# Altium project Jellyfish.PrjPCB
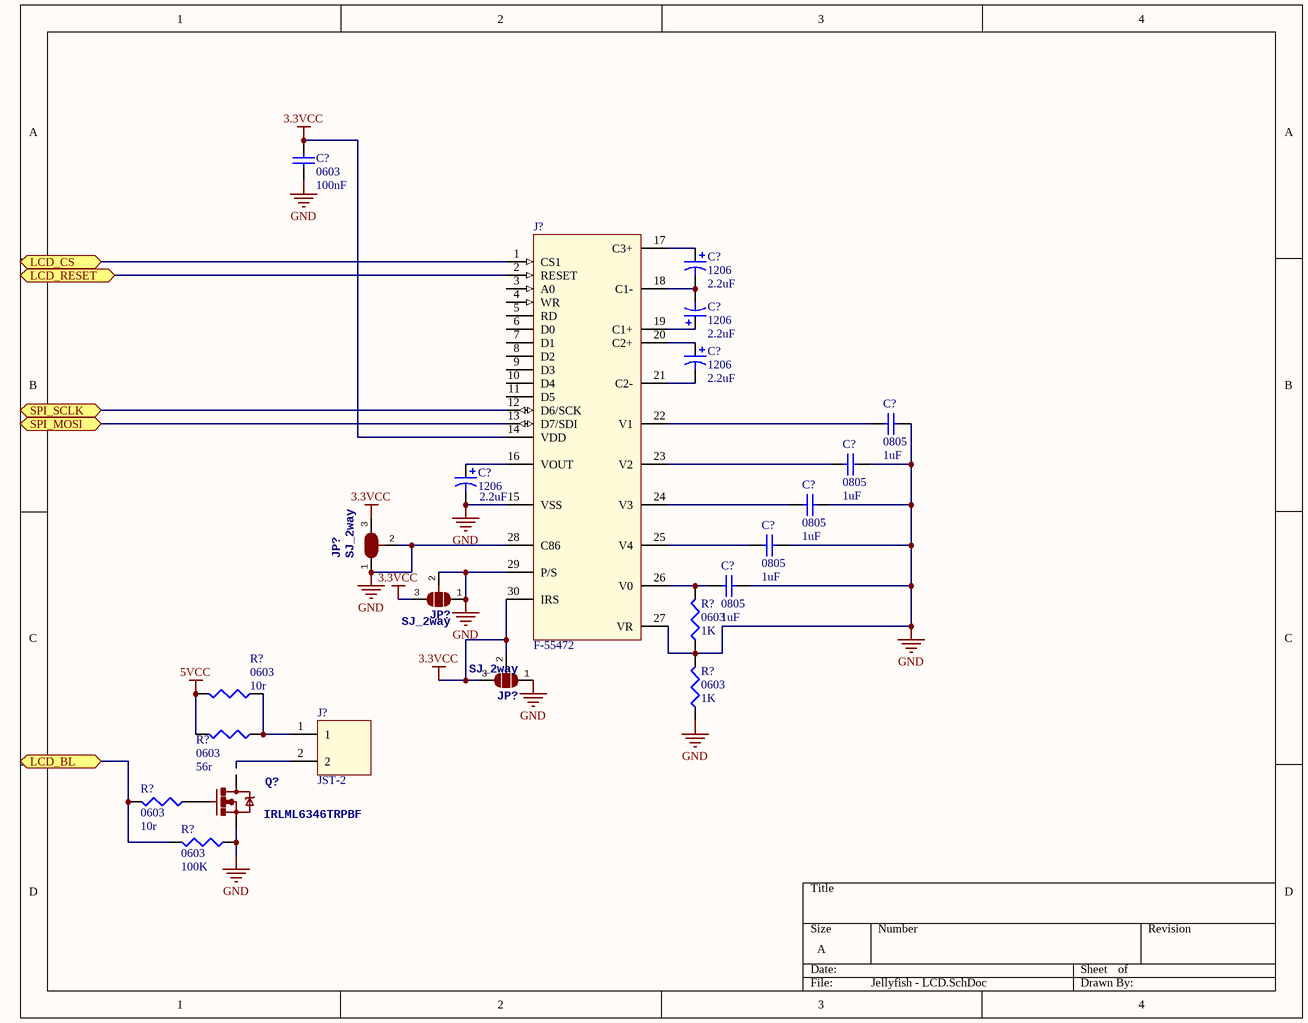
[diagram p0: Jellyfish - LCD.SchDoc]
4 sheets, 69 parts. Net scope: flat (ports and power ports of the same name join across sheets).
Sheets:
  Jellyfish - LCD.SchDoc
  Jellyfish - MCU KL05.SchDoc
  Jellyfish - Connector and SD Slot.SchDoc
  Jellyfish - LEDs & Buzzer.SchDoc

## Sheet Jellyfish - LCD.SchDoc
size A

### Parts
(Parts that share a designator on the sheet are numbered #1, #2 ... from top to bottom, then left to right.)
C?#1  0603  value 100nF  [1608[0603]]
C?#2  1206  value 2.2uF  [C1206Tantalum]
C?#3  1206  value 2.2uF  [C1206Tantalum]
C?#4  1206  value 2.2uF  [C1206Tantalum]
C?#5  0805  value 1uF  [SM 0805 - gap trimmed]
C?#6  0805  value 1uF  [SM 0805 - gap trimmed]
C?#7  1206  value 2.2uF  [C1206Tantalum]
C?#8  0805  value 1uF  [SM 0805 - gap trimmed]
C?#9  0805  value 1uF  [SM 0805 - gap trimmed]
C?#10  0805  value 1uF  [SM 0805 - gap trimmed]
J?#1  F-55472  [10051922-3010ELF]
J?#2  JST-2  [JST-2]
JP?#1  SJ_2way  [SJ-2way]
JP?#2  SJ_2way  [SJ-2way]
JP?#3  SJ_2way  [SJ-2way]
Q?  IRLML6346TRPBF  [SOT23-3]
R?#1  0603  value 1K  [J1-0603]
R?#2  0603  value 10r  [J1-0603]
R?#3  0603  value 1K  [J1-0603]
R?#4  0603  value 56r  [J1-0603]
R?#5  0603  value 10r  [J1-0603]
R?#6  0603  value 100K  [J1-0603]

### Ports
LCD_BL, LCD_CS, LCD_RESET, SPI_MOSI, SPI_SCLK

### Nets
3.3VCC: C?#1.2 J?#1.14(VDD) J?#1.30(IRS) JP?#1.3 JP?#2.3 JP?#3.2 JP?#3.3
5VCC: R?#2.2 R?#4.2
GND: C?#1.1 C?#5.2 C?#6.2 C?#7.2 C?#8.2 C?#9.2 C?#10.2 J?#1.15(VSS) J?#1.27(VR) J?#1.28(C86) J?#1.29(P/S) JP?#1.1 JP?#1.2 JP?#2.1 JP?#2.2 JP?#3.1 Q?.2(S) R?#1.1 R?#3.1 R?#3.2 R?#6.1
LCD_CS: J?#1.1(CS1) ; port LCD_CS
LCD_RESET: J?#1.2(RESET) ; port LCD_RESET
SPI_MOSI: J?#1.13(D7/SDI) ; port SPI_MOSI
SPI_SCLK: J?#1.12(D6/SCK) ; port SPI_SCLK
NetC?#2_1: C?#2.1 J?#1.17(C3+)
NetC?#2_2: C?#2.2 C?#3.2 J?#1.18(C1-)
NetC?#3_1: C?#3.1 J?#1.19(C1+)
NetC?#4_1: C?#4.1 J?#1.20(C2+)
NetC?#4_2: C?#4.2 J?#1.21(C2-)
NetC?#5_1: C?#5.1 J?#1.22(V1)
NetC?#6_1: C?#6.1 J?#1.23(V2)
NetC?#7_1: C?#7.1 J?#1.16(VOUT)
NetC?#8_1: C?#8.1 J?#1.24(V3)
NetC?#9_1: C?#9.1 J?#1.25(V4)
NetC?#10_1: C?#10.1 J?#1.26(V0) R?#1.2
NetJ?#2_1: J?#2.1 R?#2.1 R?#4.1
NetQ?_1: Q?.1(G) R?#5.1
NetR?#5_2: R?#5.2 R?#6.2 ; port LCD_BL

Not connected (* = marked no-connect by the designer): J?#1 3(A0) 4(WR) 5(RD) 6(D0) 7(D1) 8(D2) 9(D3) 10(D4) 11(D5); J?#2 2; Q? 3(D)

### Library data of the parts
C?#1 C?#5 C?#6 C?#8-C?#10 = Cap Semi: Capacitor (Semiconductor SIM Model); Published: 8-Jun-2000; LatestRevisionDate: 29-May-2009; LatestRevisionNote: IPC-7351 Footprint Added.; PackageReference: C1206; Publisher: Altium Limited; PackageDescription: Chip Capacitor
C?#2-C?#4 C?#7 = Cap Pol3: Polarized Capacitor (Surface Mount); Published: 8-Jun-2000; LatestRevisionDate: 29-May-2009; LatestRevisionNote: IPC-7351 Footprint Added.; PackageReference: C0805; Publisher: Altium Limited; PackageDescription: Chip Capacitor
JP?#1-JP?#3 = SJ_2way: SMD solder jumper; LastRevisionNote: ImportComponents; Published: 23-Apr-2014; Publisher: UltiMachine; LastRevisionDate: 23-Apr-2014
Q? = IRLML6346TRPBF: Mosfet N-Channel 30V 3.4A 63mOhm; LastRevisionNote: ImportComponents; LastRevisionDate: 23-Apr-2014; ManufacturerPartNumber: IRLML6346TRPBF; Published: 23-Apr-2014; Publisher: UltiMachine
R?#1-R?#6 = Res3: Resistor; Published: 8-Jun-2000; LatestRevisionDate: 29-May-2009; LatestRevisionNote: IPC-7351 Footprint Added.; PackageReference: J1-0603; Publisher: Altium Limited; PackageDescription: Chip Resistor

## Sheet Jellyfish - MCU KL05.SchDoc
size A
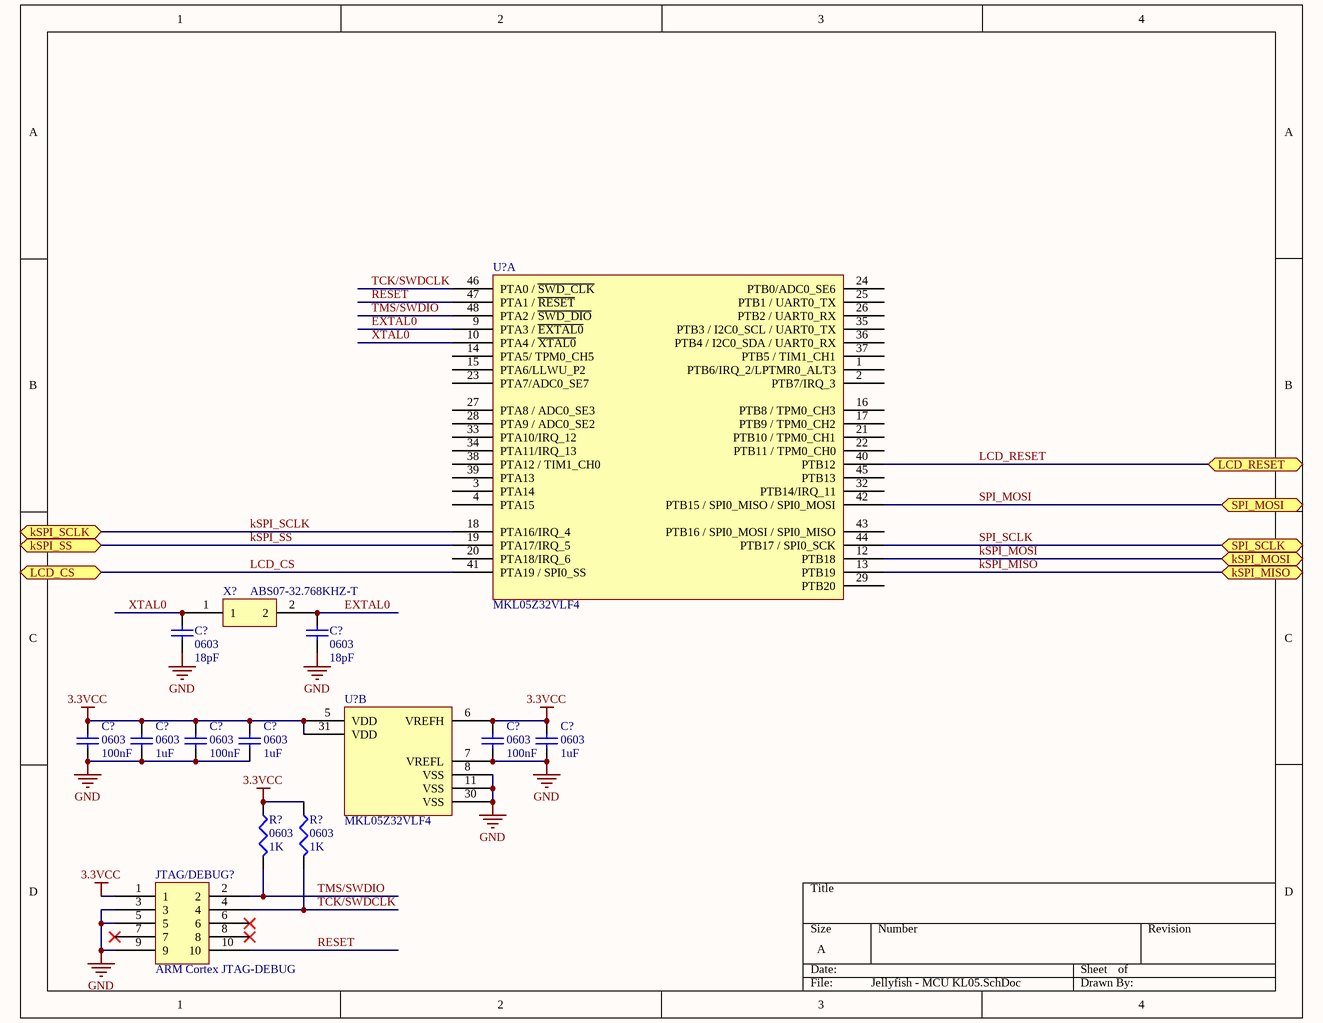
[diagram p1: Jellyfish - MCU KL05.SchDoc]

### Parts
(Parts that share a designator on the sheet are numbered #1, #2 ... from top to bottom, then left to right.)
C?#11  0603  value 18pF  [1608[0603]]
C?#12  0603  value 18pF  [1608[0603]]
C?#13  0603  value 100nF  [1608[0603]]
C?#14  0603  value 1uF  [1608[0603]]
C?#15  0603  value 100nF  [1608[0603]]
C?#16  0603  value 1uF  [1608[0603]]
C?#17  0603  value 100nF  [1608[0603]]
C?#18  0603  value 1uF  [1608[0603]]
JTAG/DEBUG?  ARM Cortex JTAG-DEBUG  [FTSH-105-XX-X-DV]
R?#7  0603  value 1K  [J1-0603]
R?#8  0603  value 1K  [J1-0603]
U?#1  MKL05Z32VLF4  [MKL05Z32VLF4]  (part A of 2)
U?#2  MKL05Z32VLF4  [MKL05Z32VLF4]  (part B of 2)
X?  ABS07-32.768KHZ-T  [ABS07-32.768KHZ-T]

### Ports
kSPI_MISO, kSPI_MOSI, kSPI_SCLK, kSPI_SS, LCD_CS, LCD_RESET, SPI_MOSI, SPI_SCLK

### Nets
3.3VCC: C?#13.1 C?#14.1 C?#15.2 C?#16.2 C?#17.2 C?#18.2 JTAG/DEBUG?.1 R?#7.1 R?#8.1 U?#2.5(VDD) U?#2.6(VREFH) U?#2.31(VDD)
GND: C?#11.2 C?#12.2 C?#13.2 C?#14.2 C?#15.1 C?#16.1 C?#17.1 C?#18.1 JTAG/DEBUG?.3 JTAG/DEBUG?.5 JTAG/DEBUG?.9 U?#2.7(VREFL) U?#2.8(VSS) U?#2.11(VSS) U?#2.30(VSS)
EXTAL0: C?#12.1 U?#1.9(PTA3_/_~{EXTAL0}) X?.2
kSPI_MISO: U?#1.13(PTB19) ; port kSPI_MISO
kSPI_MOSI: U?#1.12(PTB18) ; port kSPI_MOSI
kSPI_SCLK: U?#1.18(PTA16/IRQ_4) ; port kSPI_SCLK
kSPI_SS: U?#1.19(PTA17/IRQ_5) ; port kSPI_SS
LCD_CS: U?#1.41(PTA19_/_SPI0_SS) ; port LCD_CS
LCD_RESET: U?#1.40(PTB12) ; port LCD_RESET
RESET: JTAG/DEBUG?.10 U?#1.47(PTA1_/_~{RESET})
SPI_MOSI: U?#1.42(PTB15_/_SPI0_MISO_/_SPI0_MOSI) ; port SPI_MOSI
SPI_SCLK: U?#1.44(PTB17_/_SPI0_SCK) ; port SPI_SCLK
TCK/SWDCLK: JTAG/DEBUG?.4 R?#8.2 U?#1.46(PTA0_/_~{SWD_CLK})
TMS/SWDIO: JTAG/DEBUG?.2 R?#7.2 U?#1.48(PTA2_/_~{SWD_DIO})
XTAL0: C?#11.1 U?#1.10(PTA4_/_~{XTAL0}) X?.1

Not connected (* = marked no-connect by the designer): JTAG/DEBUG? 6* 7* 8*; U?#1 1(PTB6/IRQ_2/LPTMR0_ALT3) 2(PTB7/IRQ_3) 3(PTA14) 4(PTA15) 14(PTA5/_TPM0_CH5) 15(PTA6/LLWU_P2) 16(PTB8_/_TPM0_CH3) 17(PTB9_/_TPM0_CH2) 20(PTA18/IRQ_6) 21(PTB10_/_TPM0_CH1) 22(PTB11_/_TPM0_CH0) 23(PTA7/ADC0_SE7) 24(PTB0/ADC0_SE6) 25(PTB1_/_UART0_TX) 26(PTB2_/_UART0_RX) 27(PTA8_/_ADC0_SE3) 28(PTA9_/_ADC0_SE2) 29(PTB20) 32(PTB14/IRQ_11) 33(PTA10/IRQ_12) 34(PTA11/IRQ_13) 35(PTB3_/_I2C0_SCL_/_UART0_TX) 36(PTB4_/_I2C0_SDA_/_UART0_RX) 37(PTB5_/_TIM1_CH1) 38(PTA12_/_TIM1_CH0) 39(PTA13) 43(PTB16_/_SPI0_MOSI_/_SPI0_MISO) 45(PTB13)

### Library data of the parts
C?#11-C?#18 = Cap Semi: Capacitor (Semiconductor SIM Model); Published: 8-Jun-2000; LatestRevisionDate: 29-May-2009; LatestRevisionNote: IPC-7351 Footprint Added.; PackageReference: C1206; Publisher: Altium Limited; PackageDescription: Chip Capacitor
JTAG/DEBUG? = ARM Cortex JTAG-DEBUG Header
R?#7 R?#8 = Res3: Resistor; Published: 8-Jun-2000; LatestRevisionDate: 29-May-2009; LatestRevisionNote: IPC-7351 Footprint Added.; PackageReference: J1-0603; Publisher: Altium Limited; PackageDescription: Chip Resistor
U?#1 U?#2 = MKL05Z32VLF4: ARM Cortex M0+
X? = ABS07-32.768KHZ-T: ABS07-32.768KHZ-T RTC Crystal Oscillator

## Sheet Jellyfish - Connector and SD Slot.SchDoc
size A
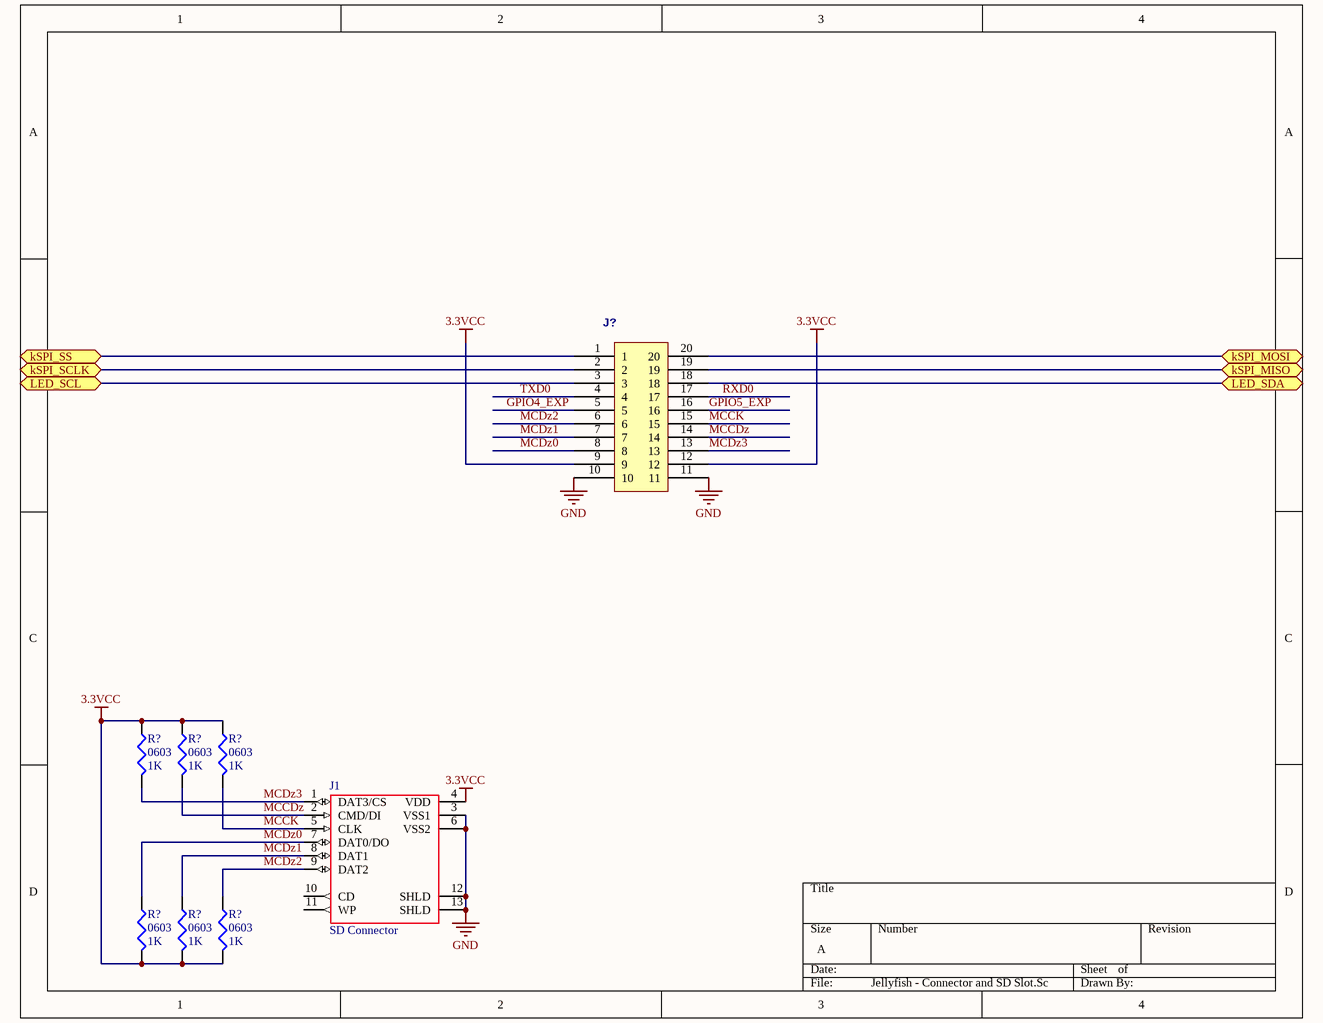
[diagram p2: Jellyfish - Connector and SD Slot.SchDoc]

### Parts
(Parts that share a designator on the sheet are numbered #1, #2 ... from top to bottom, then left to right.)
J1  SD Connector  [SD-Connector]
J?#3  10X2-0.1X0.05  [10X2-0.05X0.1w]  (value not drawn)
R?#9  0603  value 1K  [J1-0603]
R?#10  0603  value 1K  [J1-0603]
R?#11  0603  value 1K  [J1-0603]
R?#12  0603  value 1K  [J1-0603]
R?#13  0603  value 1K  [J1-0603]
R?#14  0603  value 1K  [J1-0603]

### Ports
kSPI_MISO, kSPI_MOSI, kSPI_SCLK, kSPI_SS, LED_SCL, LED_SDA

### Nets
3.3VCC: J1.4(VDD) J?#3.9 J?#3.12 R?#9.1 R?#10.1 R?#11.1 R?#12.2 R?#13.2 R?#14.2
GND: J1.3(VSS1) J1.6(VSS2) J1.12(SHLD) J1.13(SHLD) J?#3.10 J?#3.11
GPIO4_EXP: J?#3.5
GPIO5_EXP: J?#3.16
kSPI_MISO: J?#3.19 ; port kSPI_MISO
kSPI_MOSI: J?#3.20 ; port kSPI_MOSI
kSPI_SCLK: J?#3.2 ; port kSPI_SCLK
kSPI_SS: J?#3.1 ; port kSPI_SS
MCCDz: J1.2(CMD/DI) J?#3.14 R?#10.2
MCCK: J1.5(CLK) J?#3.15 R?#11.2
MCDz0: J1.7(DAT0/DO) J?#3.8 R?#12.1
MCDz1: J1.8(DAT1) J?#3.7 R?#13.1
MCDz2: J1.9(DAT2) J?#3.6 R?#14.1
MCDz3: J1.1(DAT3/CS) J?#3.13 R?#9.2
RXD0: J?#3.17
TXD0: J?#3.4
NetJ?#3_3: J?#3.3 ; port LED_SCL
NetJ?#3_18: J?#3.18 ; port LED_SDA

Not connected (* = marked no-connect by the designer): J1 10(CD) 11(WP)

### Library data of the parts
J1 = SD-connector
J?#3 = 10X2-0.1X0.05: LastRevisionNote: ImportComponents; Published: 23-Apr-2014; Publisher: UltiMachine; LastRevisionDate: 23-Apr-2014
R?#9-R?#14 = Res3: Resistor; Published: 8-Jun-2000; LatestRevisionDate: 29-May-2009; LatestRevisionNote: IPC-7351 Footprint Added.; PackageReference: J1-0603; Publisher: Altium Limited; PackageDescription: Chip Resistor

## Sheet Jellyfish - LEDs & Buzzer.SchDoc
size A
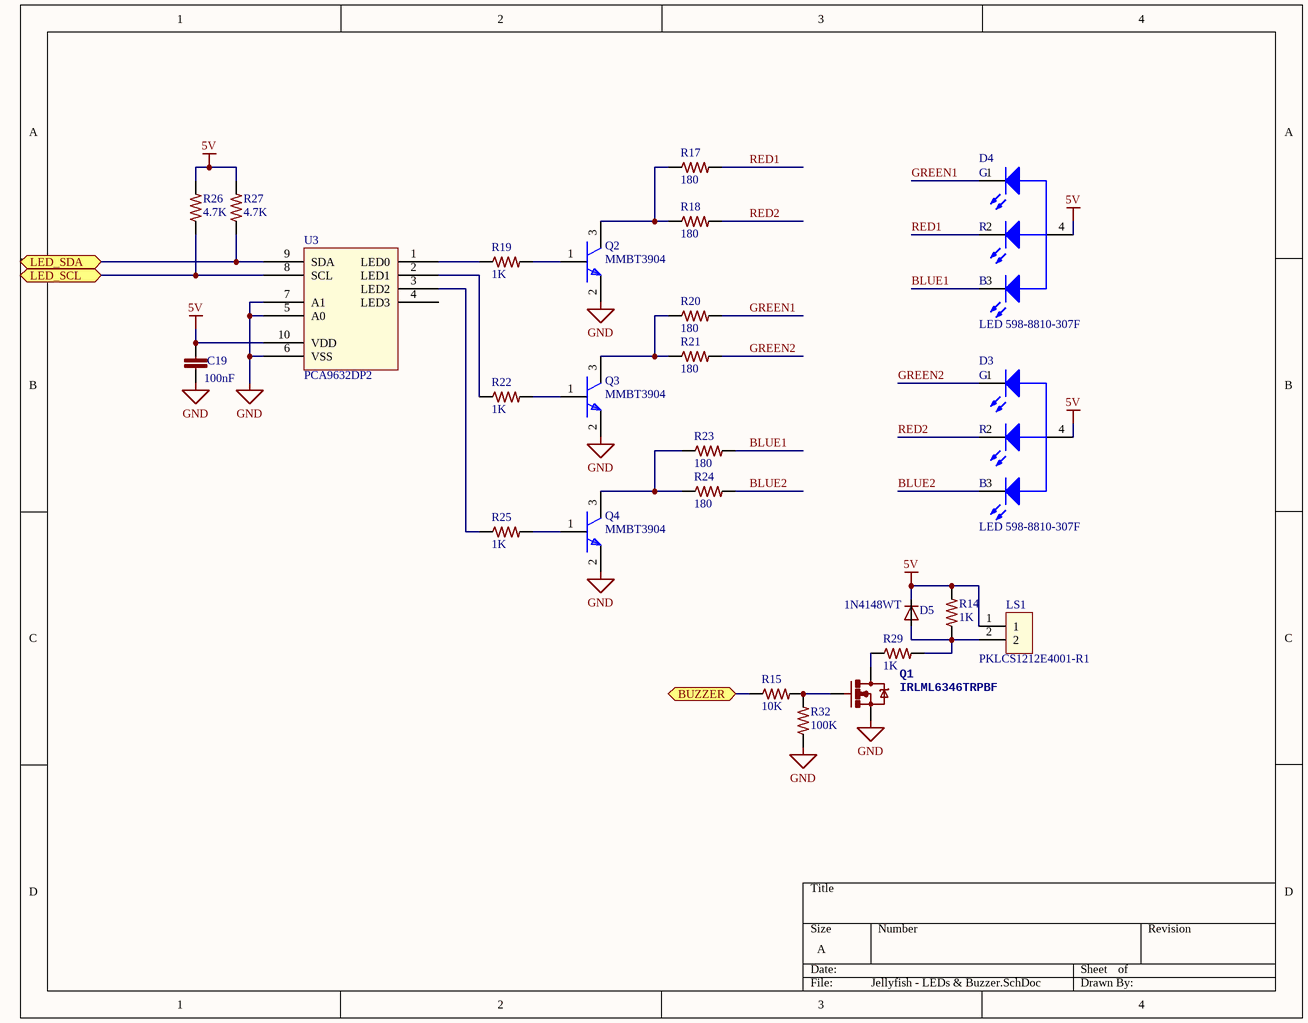
[diagram p3: Jellyfish - LEDs & Buzzer.SchDoc]

### Parts
C19  100nF  [C0402]
D3  LED 598-8810-307F  [LED SMD  598-8810-307F]
D4  LED 598-8810-307F  [LED SMD  598-8810-307F]
D5  1N4148WT  [SOD523]
LS1  PKLCS1212E4001-R1  [PKLCS1212E4001-R1]
Q1  IRLML6346TRPBF  [SOT23-3]
Q2  MMBT3904  [SOT23-3]
Q3  MMBT3904  [SOT23-3]
Q4  MMBT3904  [SOT23-3]
R14  1K  [R0603]
R15  10K  [R0603]
R17  180  [R0805]
R18  180  [R0805]
R19  1K  [R0603]
R20  180  [R0805]
R21  180  [R0805]
R22  1K  [R0603]
R23  180  [R0805]
R24  180  [R0805]
R25  1K  [R0603]
R26  4.7K  [R0603]
R27  4.7K  [R0603]
R29  1K  [R0603]
R32  100K  [R0603]
U3  PCA9632DP2  [IC TSSOP-10]

### Ports
BUZZER, LED_SCL, LED_SDA

### Nets
5V: C19.1 D3.4 D4.4 D5.C LS1.1 R14.2 R26.2 R27.2 U3.10(VDD)
GND: C19.2 Q1.2(S) Q2.2(E) Q3.2(E) Q4.2(E) R32.1 U3.5(A0) U3.6(VSS) U3.7(A1)
BLUE1: D4.3 R23.2
BLUE2: D3.3 R24.2
GREEN1: D4.1 R20.2
GREEN2: D3.1 R21.2
RED1: D4.2 R17.2
RED2: D3.2 R18.2
NetD5_A: D5.A LS1.2 R14.1 R29.2
NetJ?#3_3: R26.1 U3.8(SCL) ; port LED_SCL
NetJ?#3_18: R27.1 U3.9(SDA) ; port LED_SDA
NetQ1_1: Q1.1(G) R15.2 R32.2
NetQ1_3: Q1.3(D) R29.1
NetQ2_1: Q2.1(B) R19.2
NetQ2_3: Q2.3(C) R17.1 R18.1
NetQ3_1: Q3.1(B) R22.2
NetQ3_3: Q3.3(C) R20.1 R21.1
NetQ4_1: Q4.1(B) R25.2
NetQ4_3: Q4.3(C) R23.1 R24.1
NetR15_1: R15.1 ; port BUZZER
NetR19_1: R19.1 U3.1(LED0)
NetR22_1: R22.1 U3.2(LED1)
NetR25_1: R25.1 U3.3(LED2)

Not connected (* = marked no-connect by the designer): U3 4(LED3)

### Notes on the sheet
- (in symbol LED 598-8810-307F) G; R; B

### Library data of the parts
C19 = GRM155R71C104KA88D: CAP CER 0402 100nF 16V 10% X7R; LastRevisionNote: ImportComponents; Published: 23-Apr-2014; Publisher: UltiMachine; LastRevisionDate: 23-Apr-2014; ManufacturerPartNumber: GRM155R71C104KA88D; VALUE: 100nF
D3 D4 = LED 598-8810-307F: LED MULTICOLOR RED/GRN/BLUE 1208; Mfg: DIALIGHT; Bestel grote: 1; Prijs: 2.26; Mfg code: 598-8810-307F; Faber itemcode: -; Supplier: Farnell; Supplier code: 1850760; Remarks: -; Value: -; Max soldering temp: -; SMD: Yes; Faber Artikelomschrijving: -
D5 = 1N4148WT: DIODE SOD523; LastRevisionNote: ImportComponents; Published: 23-Apr-2014; Publisher: UltiMachine; LastRevisionDate: 23-Apr-2014; Value: 1N4148WT
Q1 = IRLML6346TRPBF: as Q? on sheet Jellyfish - LCD; LastRevisionDate: 23-Apr-2014; ManufacturerPartNumber: IRLML6346TRPBF; Published: 23-Apr-2014; Publisher: UltiMachine
R14 R19 R22 R25 R29 = ERJ-3EKF1001V: RES 0603 1K 100mW 1%; LastRevisionNote: ImportComponents; Published: 23-Apr-2014; Publisher: UltiMachine; LastRevisionDate: 23-Apr-2014; ManufacturerPartNumber: ERJ-3EKF1001V; VALUE: 1K
R15 R26 R27 = ERJ-3EKF1002V: RES 0603 10K 100mW 1%; LastRevisionNote: ImportComponents; Published: 23-Apr-2014; Publisher: UltiMachine; LastRevisionDate: 23-Apr-2014; ManufacturerPartNumber: ERJ-3EKF1002V
  R15: VALUE: 10K
  R26 R27: VALUE: 4.7K
R17 R18 R20 R21 R23 R24 = CRCW0805180RJNEA: Resistor; LastRevisionNote: ImportComponents; Published: 23-Apr-2014; Publisher: UltiMachine; LastRevisionDate: 23-Apr-2014; VALUE: 180
R32 = RC0603FR-07100KL: RES 100K OHM 1/10W 1% 0603 SMD; LastRevisionNote: ImportComponents; Published: 23-Apr-2014; Publisher: UltiMachine; LastRevisionDate: 23-Apr-2014; ManufacturerPartNumber: RC0603FR-07100KL; VALUE: 100K
U3 = IC PCA9632: IC LED DRIVER RGBA; Faber ItemCode: 36966800; Mfg: NXP; Faber Artikelomschrijving: IC PCA9632DP2 TSSOP-10 NXP; Bestel grote: 1000; Prijs: 1,0876; Max soldering temp: -; Mfg code: PCA9632DP2; Remarks: -; SMD: Yes; Supplier: Digikey; Supplier code: 568-8254-6-ND; Value: -

## Nets that join several sheets
3.3VCC: Jellyfish - LCD (7 pins), Jellyfish - MCU KL05 (12 pins), Jellyfish - Connector and SD Slot (9 pins)
GND: Jellyfish - LCD (21 pins), Jellyfish - MCU KL05 (15 pins), Jellyfish - Connector and SD Slot (6 pins), Jellyfish - LEDs & Buzzer (9 pins)
kSPI_MISO: Jellyfish - MCU KL05 (U?#1.13), Jellyfish - Connector and SD Slot (J?#3.19)
kSPI_MOSI: Jellyfish - MCU KL05 (U?#1.12), Jellyfish - Connector and SD Slot (J?#3.20)
kSPI_SCLK: Jellyfish - MCU KL05 (U?#1.18), Jellyfish - Connector and SD Slot (J?#3.2)
kSPI_SS: Jellyfish - MCU KL05 (U?#1.19), Jellyfish - Connector and SD Slot (J?#3.1)
LCD_CS: Jellyfish - LCD (J?#1.1), Jellyfish - MCU KL05 (U?#1.41)
LCD_RESET: Jellyfish - LCD (J?#1.2), Jellyfish - MCU KL05 (U?#1.40)
NetJ?#3_3: Jellyfish - Connector and SD Slot (J?#3.3), Jellyfish - LEDs & Buzzer (R26.1 U3.8)
NetJ?#3_18: Jellyfish - Connector and SD Slot (J?#3.18), Jellyfish - LEDs & Buzzer (R27.1 U3.9)
SPI_MOSI: Jellyfish - LCD (J?#1.13), Jellyfish - MCU KL05 (U?#1.42)
SPI_SCLK: Jellyfish - LCD (J?#1.12), Jellyfish - MCU KL05 (U?#1.44)